# EasyEDA Pro project ProProject_无线温湿度检测系统1_2024-10-27.epro, board V2.0
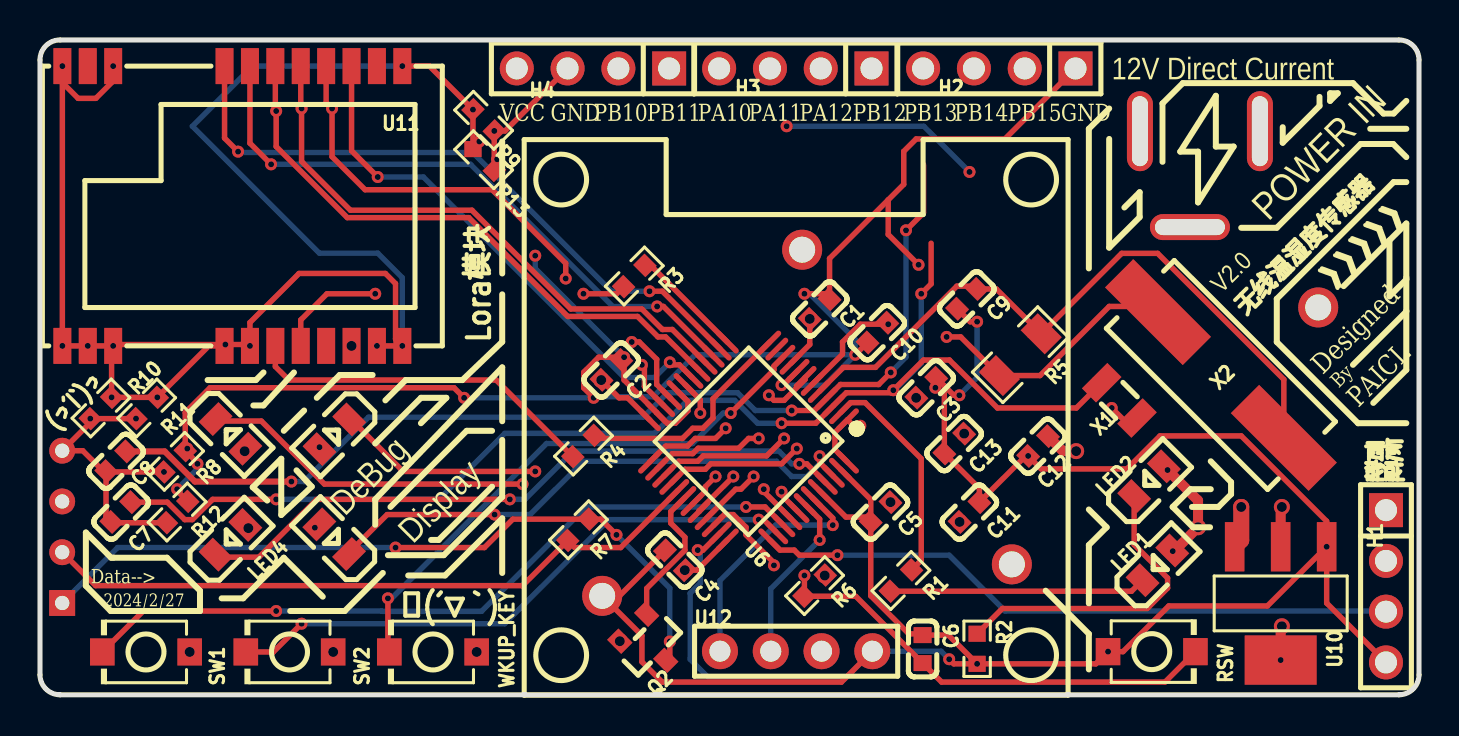
[diagram p5: board, top side]
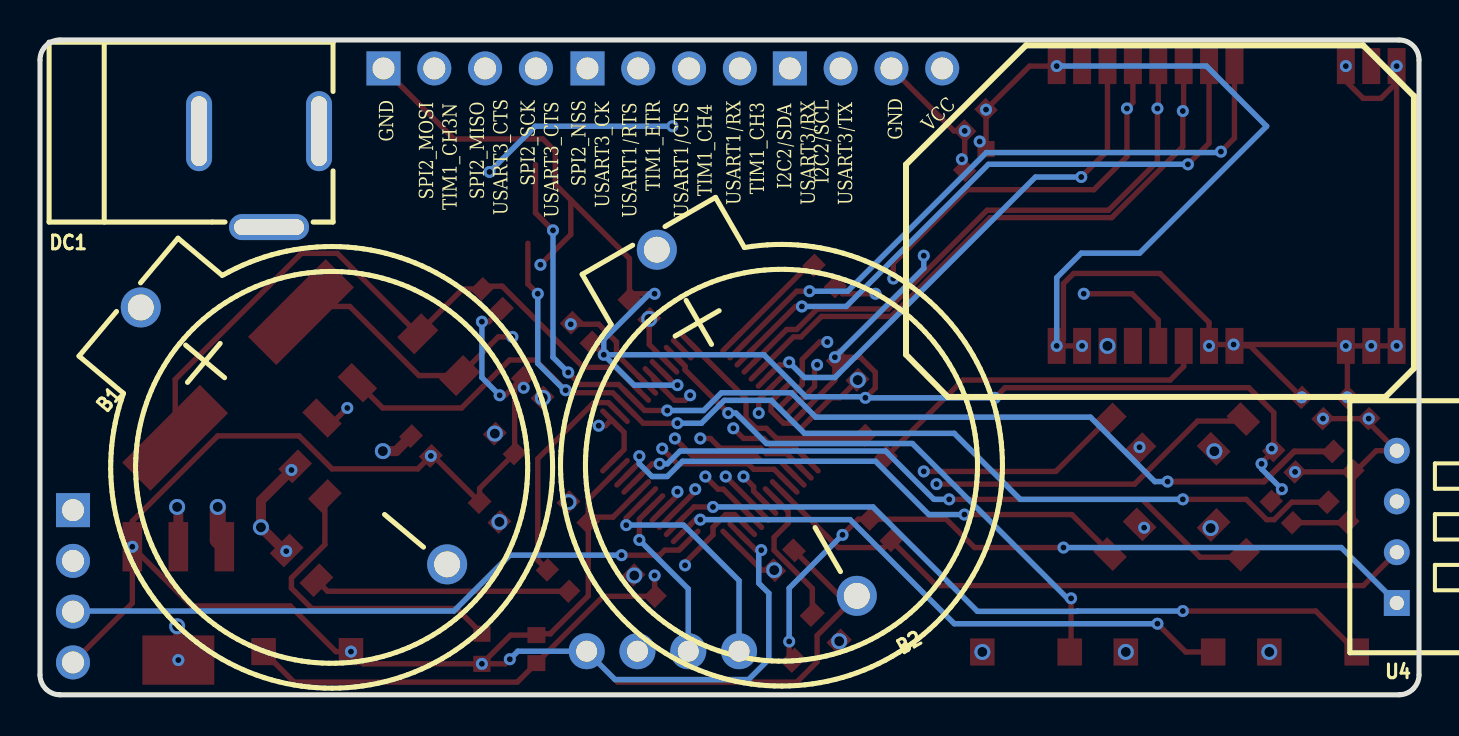
[diagram p6: board, bottom side, seen from below]

Outline 68.96 x 32.77 mm; copper layers: Top Layer, Inner1, Inner2, Bottom Layer. Coordinates in mm from the lower left corner of the outline.
Outline path: 0,31.77 0,1 arc(0.29,0.29) 1,0 67.96,0 arc(68.67,0.29) 68.96,1 68.96,31.77 arc(68.67,32.47) 67.96,32.77 1,32.77 arc(0.29,32.47) 0,31.77
Stack: Top Layer 0.035mm 外层铜厚1oz / Dielectric1 0.2104mm 7628 RC49% 8.6mil / Inner1 0.0152mm 内层铜厚 / Dielectric2 1.065mm 1.1mm H/HOZ 含铜 / Inner2 0.0152mm 内层铜厚 / Dielectric3 0.2104mm 7628 RC49% 8.6mil / Bottom Layer 0.035mm 外层铜厚1oz

## Design rules (mm)
template: JLCPCB Capability(Two Layers Board)
spacing copperThickness1oz (default): track to track 0.102, other pairs 0.152 to 0.3
spacing copperThickness2oz: track to track 0.203, other pairs 0.152 to 0.3
track width copperThickness1oz (default): min 0.127, default 0.254, max 2.54
track width copperThickness2oz: min 0.203, default 0.254, max 2.54
differential pair differentialPair (default): width min 0.127, default 0.254, max 2.54; gap min 0.152, default 0.152
via viaSize (default): diameter min 0.5, default 0.61, max 10; hole min 0.3, default 0.305, max 6.3

## Placement (name value [footprint] x y rotation side)
B1  BS-2-1  [BAT-TH_BS-2-1]  56.26 12.95 310 bottom
B2  BS-2-1  [BAT-TH_BS-2-1]  33.11 13.61 330 bottom
C1  100nF  [C0603]  38.99 19.3 225 top
C2  100nF  [C0603]  28.57 16.26 45 top
C3  100nF  [C0603]  44.32 15.37 45 top
C4  100nF  [C0603]  31.75 6.73 315 top
C5  100nF  [C0603]  42.04 9.14 45 top
C6  1uF  [C0603]  44.14 2.29 270 top
C7  20pF  [C0603]  4.06 9.14 45 top
C8  20pF  [C0603]  3.81 11.68 45 top
C9  20pF  [C0603]  46.35 19.81 45 top
C10  20pF  [C0603]  41.88 18.12 45 top
C11  100nF  [C0603]  46.48 9.14 45 top
C12  1uF  [C0603]  49.91 12.45 45 top
C13  1uF  [C0603]  45.72 12.57 45 top
DC1  DC-005 2.0  [DC-IN-TH_DC-5520-1]  58.01 25.8 180 bottom
H1  烧录  [HDR-TH_4P-P2.54-V-M]  67.31 5.43 270 top
H2  烧录  [HDR-TH_4P-P2.54-V-M]  47.97 31.34 180 top
H3  烧录  [HDR-TH_4P-P2.54-V-M]  37.77 31.34 180 top
H4  烧录  [HDR-TH_4P-P2.54-V-M]  27.65 31.34 180 top
LED1  NCD0805R1  [LED0805-R-RD]  55.88 6.48 45 top
LED2  NCD0805R1  [LED0805-R-RD]  55.46 10.69 45 top
LED3  NCD0805R1  [LED0805-R-RD]  14.71 7.78 135 top
LED4  NCD0805R1  [LED0805-R-RD]  9.53 7.76 45 top
LED5  NCD0805R1  [LED0805-R-RD]  9.53 13.05 315 top
LED6  NCD0805R1  [LED0805-R-RD]  14.72 13.03 225 top
Q2  AO3401A  [SOT-23_L2.9-W1.3-P1.90-LS2.4-BR]  30.48 2.54 135 top
R1  510Ω  [R0603]  43.05 5.72 45 top
R2  510Ω  [R0603]  46.86 2.3 270 top
R3  200Ω  [R0603]  29.72 20.95 45 top
R4  200Ω  [R0603]  27.18 12.45 45 top
R5  1mΩ  [R1206]  49.02 17.02 45 top
R6  10kΩ  [R0603]  38.74 5.46 45 top
R7  4.7kΩ  [R0603]  26.92 8.26 45 top
R8  510Ω  [R0603]  6.73 11.68 225 top
R9  510Ω  [R0603]  22.19 28.75 135 top
R10  510Ω  [R0603]  3.05 14.35 45 top
R11  510Ω  [R0603]  5.33 14.35 45 top
R12  510Ω  [R0603]  6.86 9.14 225 top
R13  510Ω  [r0603]  22.19 26.77 135 top
RSW  TS-1088R-02026  [SW-SMD_L3.9-W3.0-P4.45]  55.6 2.16 0 top
SW1  TS-1088-AR02016  [SW-SMD_L3.9-W3.0-P4.45]  5.3 2.14 180 top
SW2  TS-1088-AR02016  [SW-SMD_L3.9-W3.0-P4.45]  12.48 2.14 180 top
U4  DHT11  [SENSOR-TH_DHT11]  1.11 8.4 90 bottom
U6  STM32F103C8T6  [LQFP-48_L7.0-W7.0-P0.50-LS9.0-BL]  35.43 12.7 135 top
U10  AMS1117-3.3  [SOT-223-4_L6.5-W3.5-P2.30-LS7.0-BR]  62.04 4.57 90 top
U11  E22-400M22S  [WIRELM-SMD_E22-400M22S]  9.62 24.46 270 top
U12  HS96L03W2C03  [OLED-TH_L27.8-W27.2-P2.54_C9900033791]  37.81 2.18 180 top
WKUP_KEY  TS-1088-AR02016  [SW-SMD_L3.9-W3.0-P4.45]  19.65 2.14 180 top
X1  32.768kHz  [FC-135R_L3.2-W1.5]  53.97 14.73 135 top
X2  8MHz  [CRYSTAL-SMD_L11.5-W4.8-LS12.7]  59.06 16 135 top

## Footprints (pads in the part's own frame, mm; a bottom-side part is the same pattern mirrored in y, then rotated)
BAT-TH_BS-2-1
  round 2 hole 1.3: 1(0,-10) 2(0,10)
C0603
  rect 0.8x0.9 smd: 1(-0.7,0) 2(0.7,0)
CRYSTAL-SMD_L11.5-W4.8-LS12.7
  rect 5.5x2 smd: 1(-4.45,0) 2(4.45,0)
DC-IN-TH_DC-5520-1
  oval 4x1.3 hole 3.5x0.8: 2(0.5,-2.4)
  oval 1.3x4 hole 0.8x3.5: 3(-3,2.4) 4(3,2.4)
FC-135R_L3.2-W1.5
  rect 1x1.8 smd: 1(-1.25,0) 2(1.25,0)
HDR-TH_4P-P2.54-V-M
  rect 1.7x1.7 hole 1.1: 1(-3.81,0)
  round 1.7 hole 1.1: 2(-1.27,0) 3(1.27,0) 4(3.81,0)
LED0805-R-RD
  rect 1x1.399 smd: 1(1.05,0) 2(-1.05,0)
LQFP-48_L7.0-W7.0-P0.50-LS9.0-BL
  oval 0.27x1.5 smd: 1(-2.75,-4.25) 2(-2.25,-4.25) 3(-1.75,-4.25) 4(-1.25,-4.25) 5(-0.75,-4.25) 6(-0.25,-4.25) 7(0.25,-4.25) 8(0.75,-4.25) 9(1.25,-4.25) 10(1.75,-4.25) 11(2.25,-4.25) 12(2.75,-4.25) 25(2.75,4.25) 26(2.25,4.25) 27(1.75,4.25) 28(1.25,4.25) 29(0.75,4.25) 30(0.25,4.25) 31(-0.25,4.25) 32(-0.75,4.25) 33(-1.25,4.25) 34(-1.75,4.25) 35(-2.25,4.25) 36(-2.75,4.25)
  oval 1.5x0.27 smd: 13(4.25,-2.75) 14(4.25,-2.25) 15(4.25,-1.75) 16(4.25,-1.25) 17(4.25,-0.75) 18(4.25,-0.25) 19(4.25,0.25) 20(4.25,0.75) 21(4.25,1.25) 22(4.25,1.75) 23(4.25,2.25) 24(4.25,2.75) 37(-4.25,2.75) 38(-4.25,2.25) 39(-4.25,1.75) 40(-4.25,1.25) 41(-4.25,0.75) 42(-4.25,0.25) 43(-4.25,-0.25) 44(-4.25,-0.75) 45(-4.25,-1.25) 46(-4.25,-1.75) 47(-4.25,-2.25) 48(-4.25,-2.75)
OLED-TH_L27.8-W27.2-P2.54_C9900033791
  round 1.8 hole 1.05: 1(-3.81,0) 2(-1.27,0) 3(1.27,0) 4(3.81,0)
R0603
  rect 0.806x0.864 smd: 1(-0.753,0) 2(0.753,0)
r0603
  rect 0.806x0.864 smd: 1(-0.753,0)
  rect 0.806x0.864 smd rot 135: 2(0.753,0)
R1206
  rect 1.208x1.701 smd: 1(-1.479,0) 2(1.479,0)
SENSOR-TH_DHT11
  rect 1.296x1.296 hole 0.711: 1(-3.81,0)
  round 1.296 hole 0.711: 2(-1.27,0) 3(1.27,0) 4(3.81,0)
SOT-23_L2.9-W1.3-P1.90-LS2.4-BR
  rect 1x0.8 smd: 1(1.15,-0.95) 2(1.15,0.95) 3(-1.15,0)
SOT-223-4_L6.5-W3.5-P2.30-LS7.0-BR
  rect 2.47x0.98 smd: 1(2.835,-2.3) 2(2.835,0) 3(2.835,2.3)
  rect 2.47x3.6 smd: 4(-2.835,0)
SW-SMD_L3.9-W3.0-P4.45
  rect 1.23x1.36 smd: 1(-2.185,0) 2(2.185,0)
WIRELM-SMD_E22-400M22S
  rect 1.8x0.9 smd: 1(7,-8.5) 2(7,-7.23) 3(7,-5.96) 4(7,-0.39) 5(7,0.88) 6(7,2.15) 7(7,3.42) 8(7,4.69) 9(7,5.96) 10(7,7.23) 11(7,8.5) 12(-7,8.5) 13(-7,7.23) 14(-7,5.96) 15(-7,4.69) 16(-7,3.42) 17(-7,2.15) 18(-7,0.88) 19(-7,-0.39) 20(-7,-5.96) 21(-7,-7.23) 22(-7,-8.5)

## Nets
12V&B_VCC: B1.1 C12.2 DC1.4 U10.3
AGND: C7.1 C8.1 R8.2 R10.1 R11.1 R12.2 U4.4
DGND: R9.2 R10.2 R11.2 R13.2 U11.1 U11.2 U11.3 U11.4 U11.5 U11.10 U11.11 U11.12 U11.20 U11.22
GND: B2.2 C1.1 C2.2 C3.2 C4.1 C5.1 C6.1 C9.1 C10.1 C11.2 C12.1 C13.1 DC1.2 DC1.3 H1.4 H2.1 H4.3 R2.2 R8.1 R9.1 R12.1 R13.1 RSW.1 U6.8 U6.20 U6.23 U6.35 U6.44 U6.47 U10.1 U12.1
VCC: C1.2 C2.1 C3.1 C4.2 C5.2 C11.1 C13.2 H1.1 H4.4 LED1.1 LED2.1 LED3.1 LED4.1 LED5.1 LED6.1 Q2.2 R6.2 SW1.1 SW2.1 U6.1 U6.9 U6.24 U6.36 U6.48 U10.2 U10.4 U11.9 U12.2 WKUP_KEY.1
DHT11_VCC: Q2.3 R7.2 U4.1
NRST: C6.2 R6.1 RSW.2 U6.7
PA2/USART2_TX: R4.2 U6.12
PA3/USART2_RX: R3.2 U6.13
PA4/SPI1_NSS: U6.14 U11.19
PA5/SPI1_SCK: U6.15 U11.18
PA6/SPI1_MISO: U6.16 U11.16
PA7/SPI1_MOSI: U6.17 U11.17
PA8/DATA: R7.1 U4.2 U6.29
PA9/DHT11_CONTROL_VCC: Q2.1 U6.30
PA10/OUT: H3.4 U6.31
PA11/OUT: H3.3 U6.32
PA12/OUT: H3.2 U6.33
PA15/KEY2: SW2.2 U6.38
PB0/BUSY: U6.18 U11.14
PB1/NRST: U6.19 U11.15
PB3/KEY1: SW1.2 U6.39
PB4/DEBUG4: LED6.2 U6.40
PB5/DEBUG3: LED5.2 U6.41
PB6/I2C1_SCL: U6.42 U12.3
PB7/I2C1_SDA: U6.43 U12.4
PB8/DEBUG2: LED4.2 U6.45
PB9/DEBUG1: LED3.2 U6.46
PB10/OUT: H4.2 U6.21
PB11/OUT: H4.1 U6.22
PB12/OUT: H3.1 U6.25
PB13/OUT: H2.4 U6.26
PB14/OUT: H2.3 U6.27
PB15/OUT: H2.2 U6.28
PC13/TAMPER-RTC: R1.2 U6.2
PC14/OSC32_IN: C7.2 U6.3 X1.2
PC15/OSC32_OUT: C8.2 U6.4 X1.1
PD0/OSC_IN: C9.2 R5.2 U6.5 X2.1
PD1/OSC_OUT: C10.2 R5.1 U6.6 X2.2
SWDCLK: H1.3 U6.37
SWDIO: H1.2 U6.34
WKUP_KEY: U6.10 WKUP_KEY.2
$1N1536: LED2.2 R2.1
$1N1537: LED1.2 R1.1
$1N1721: R4.1 U11.6
$1N1727: R3.1 U11.7
$1N4011: B1.2 B2.1

Pads without a net: U4 3; U6 11; U11 8 13 21

## Via types
v1: diameter 0.6, hole 0.3, Top Layer to Bottom Layer, 103 vias
v2: diameter 0.8, hole 0.5, Top Layer to Bottom Layer, 20 vias

## Routing (per net, layer and track width the routed paths; a pad name or vN(x,y) marks a point on that pad's centre or on a via; arc(x,y) is an arc through that point)
12V&B_VCC: length 38.5
  Top Layer w0.5: 50.41,12.94 51.16,12.19 v2(51.82,12.19)
  Top Layer w0.8: U10.3 60.07,7.73 v2(60.07,9.4)
  Inner2 w0.8: DC1.4 57.01,28.2 63.92,21.3 B1.1 63.92,13.25 v2(60.07,9.4) 57.28,12.19 v2(51.82,12.19)
AGND: length 15.3
  Top Layer w0.27: R12.2 3.61,8.61 3.3,8.92 3.3,11.05 2.14,12.21 U4.4 2.52,13.62 v1(2.52,13.82) v1(4.8,13.82) ; v1(6.2,11.15) 3.35,11.15 C8.1
DGND: length 86.1
  Top Layer w0.27: v1(1.12,31.46) 1.12,30.63 ; 1.12,30.63 v1(1.12,17.46) v1(2.39,17.46) v1(3.66,17.46) ; 1.12,30.63 1.91,29.84 2.79,29.84 3.66,30.71 v1(3.66,31.46) ; v1(3.66,17.46) 3.73,17.53 v1(9.27,17.53) 10.43,17.53 v1(10.5,17.46) 10.5,18.63 12.95,21.08 17.27,21.08 17.78,20.57 17.78,17.8 v1(18.12,17.46) v1(16.85,17.46) ; v1(3.66,17.46) 3.58,17.38 v1(3.58,14.88) v1(5.87,14.88) 8.44,17.46 U11.4 ; R13.2 v1(21.65,29.28) 19.47,31.46 v1(18.12,31.46)
  Bottom Layer w0.27: v1(18.12,31.46) 10.63,31.46 7.62,28.45 13.97,22.1 16.89,22.1 18.12,20.87 v1(18.12,17.46)
  vias: v1(21.97,27.69)
GND: length 259.8
  Top Layer w0.27: 42.42,24.77 42.42,23.03 v1(43.93,21.52) ; 42.42,24.77 39.48,21.83 C1.1 39.22,20.07 v1(38.23,20.07) ; 42.42,24.77 43.19,25.54 43.19,27.19 43.81,27.81 48.25,27.81 H2.1 ; U6.8 37.17,15.49 v1(37.08,15.49) ; R12.1 6.86,10.21 v1(6.86,10.29) ; C5.1 41.3,8.89 40.3,8.89 U6.44 ; C5.1 41.54,4.95 43.43,3.06 43.43,3.05 44.07,3.05 C6.1 45.43,2.99 v1(46.86,1.55) ; C5.1 41.54,9.77 40.03,11.29 ; v1(46.86,1.55) 52.8,1.55 v1(53.41,2.16) 54.16,2.16 56.45,4.45 61.38,4.45 v1(64.34,7.41) ; v1(46.86,1.55) 45.7,1.55 v1(45.47,1.78) ; C10.1 v1(40.77,17.01) 40.77,16.89 ; v1(45.97,14.99) 45.69,14.99 45.22,15.45 ; v1(32.89,7.24) 33.15,7.24 34.02,8.1 ; C4.1 28.98,4.95 B2.2 30.1,2.97 30.1,1.65 31.12,0.64 40.08,0.64 U12.1 ; U6.20 32.4,14.67 32.4,14.21 31.78,13.59 31.36,13.59 U6.23 30.84,14.12 29.21,15.75 v1(29.21,16.89) 27.94,16.89 27.19,16.14 27.19,15.35 v1(27.69,14.86) ; C3.2 45.22,15.45 ; 45.22,15.45 45.22,12.08 46.98,10.33 C11.2 49.29,11.95 v1(49.42,11.95) 50.06,11.3 54.36,11.3 56.01,12.95 60.07,12.95 64.34,8.68 v1(64.34,7.41) ; 26.38,31.34 23.26,28.22 v1(22.72,28.22) R13.1 ; v1(46.86,18.67) 46.51,18.67 C9.1 ; v1(64.34,7.41) 64.34,4.59 H1.4 ; v1(21.21,14.86) 20.7,15.37 8.51,15.37 7.26,14.12 R8.1 7.87,11.61 v1(7.87,11.56)
  Inner1 w0.27: 26.38,31.34 26.38,23.59 v1(24.76,21.97) ; v1(43.93,21.52) 46.78,18.67 v1(46.86,18.67) ; DC1.3 57.87,31.34 H2.1 51.78,26.2 54.58,23.4 DC1.2
  Bottom Layer w0.27: v1(46.86,18.67) 46.86,15.88 v1(45.97,14.99) ; v1(40.77,17.01) 40.77,17.78 38.48,20.07 v1(38.23,20.07) ; v1(40.77,17.01) 32.76,17.01 30.66,14.91 27.74,14.91 v1(27.69,14.86) v1(21.21,14.86) ; v1(40.77,17.01) 39.25,15.49 v1(37.08,15.49) ; v1(24.76,21.97) 24.76,21.34 v1(29.21,16.89) ; v1(6.86,10.29) 7.87,11.3 v1(7.87,11.56) ; v1(45.47,1.78) 45.06,2.18 U12.1 40.21,0.76 33.53,0.76 32.51,1.78 32.51,5.08 33.02,5.59 33.02,7.11 v1(32.89,7.24)
  vias: v1(7.37,12.32) v1(22.86,26.8) v1(44.78,15.36)
VCC: length 213.8
  Top Layer w0.27: v2(28.07,15.75) 28.96,14.86 29.38,14.86 U6.24 ; v1(41.02,13.46) 40.68,13.46 U6.1 39.75,13.13 39.75,12.27 U6.48 ; v2(32.25,6.24) 32.86,6.24 U6.36 ; v2(39.24,5.97) R6.2 ; U6.9 38.49,17.53 v2(38.49,18.81)
  Top Layer w0.5: U10.2 62.04,9.34 v2(62.1,9.4) ; v2(62.1,3.43) 62.04,3.37 v1(62.04,1.74) ; LED1.1 56.75,7.22 v2(57.91,8.38) 57.91,9.72 LED2.1
  Inner2 w0.27: v1(37.34,28.45) 26.74,28.45 H4.4 ; v2(45.99,8.65) 45.99,6.59 48.64,3.94 50.67,3.94 56.39,9.65 v1(56.39,11.25) 50.86,11.25 50.29,11.81 50.29,13.97 45.97,18.29 45.97,25.65 v1(46.48,26.16) ; v2(62.1,9.4) 61.09,8.38 v2(57.91,8.38) ; v2(38.49,18.81) 38.49,15.99 v1(41.02,13.46)
  Inner2 w0.5: H1.1 67.15,9.4 v2(62.1,9.4) v2(62.1,3.43) ; v1(13.75,8.36) 13.73,8.34 v2(10.42,8.34) ; v2(42.53,9.64) 42.54,9.63 42.54,8.62 39.89,5.97 v2(39.24,5.97) 39.24,5.46 ; v2(42.53,9.64) 42.53,11.95 v1(41.02,13.46) 42.42,13.46 v2(43.81,14.86) 45.61,13.07 v2(46.22,13.07) ; v2(42.53,9.64) 45,9.64 v2(45.99,8.65) ; v2(10.42,8.34) 10.42,12 v2(10.23,12.19) 13.78,12.19 v1(13.98,12.39) 15.06,12.39 15.58,12.91 v2(15.58,17.46) ; v2(10.42,8.34) 10.42,5.08 v2(7.49,2.14) v2(14.66,2.14) v2(21.84,2.14) 28.46,2.14 v2(29,2.68) 29,2.99 v2(32.25,6.24) ; 39.24,5.46 39.24,2.34 U12.2 ; 39.24,5.46 38.48,4.7 33.78,4.7 v2(32.25,6.24) ; v2(32.25,6.24) 32,6.48 23.88,6.48 21.59,8.76 21.59,9.91 27.43,15.75 v2(28.07,15.75)
  Bottom Layer w0.27: v1(46.48,26.16) 44.2,28.45 v1(37.34,28.45)
  vias: v1(56.65,7.19)
DHT11_VCC: length 37.2
  Top Layer w0.27: v1(28.83,8) 28.04,8.79 R7.2 23.65,8.79 22.22,7.37 v1(17.78,7.37) ; 31.29,1.73 31.5,1.93 v1(31.5,2.67)
  Bottom Layer w0.27: v1(17.78,7.37) 3.88,7.37 U4.1 ; v1(31.5,2.67) 31.5,5.33 v1(28.83,8)
NRST: length 35.2
  Top Layer w0.27: v1(38.23,5.97) 38.23,4.95 R6.1 40.79,4.93 C6.2 45.09,0.64 56.26,0.64 RSW.2 ; U6.7 38.26,15.78 37.21,14.73 36.7,14.73 v1(36.45,14.99)
  Inner1 w0.27: v1(38.23,5.97) 38.23,9.91 36.58,11.56 36.58,13.08 36.45,13.21 v1(36.45,14.99)
PA2/USART2_TX: length 11.4
  Top Layer w0.27: U6.12 33.66,14.81 33.66,13.84 33.15,13.34 32.64,13.34 32.13,12.83 27.86,12.83 R4.2
PA3/USART2_RX: length 5.7
  Top Layer w0.27: R3.2 30.53,21.49 U6.13
PA4/SPI1_NSS: length 32.8
  Top Layer w0.27: 34.02,17.3 31.12,20.19 v1(30.48,20.19) ; v1(9.91,27.18) 9.23,27.86 U11.19
  Bottom Layer w0.27: v1(9.91,27.18) 9.95,27.13 21.64,27.13 28.57,20.19 v1(30.48,20.19)
PA5/SPI1_SCK: length 31.4
  Top Layer w0.27: v1(30.86,19.43) 31.18,19.43 U6.15 ; U11.18 10.5,27.6 v1(11.56,26.54)
  Bottom Layer w0.27: v1(30.86,19.43) 28.64,19.43 21.53,26.54 v1(11.56,26.54)
PA6/SPI1_MISO: length 29.2
  Top Layer w0.27: U11.16 13.04,29.38 v1(13.08,29.34) 13.08,26.69 15.52,24.25 21.6,24.25 26.54,19.3 30.1,19.3 31.12,18.28 31.62,18.28 U6.16
PA7/SPI1_MOSI: length 29.8
  Top Layer w0.27: U6.17 31.29,17.91 30.91,17.91 29.88,18.93 26.39,18.93 21.45,23.88 15.37,23.88 11.81,27.43 v1(11.81,29.21) 11.77,29.25 U11.17
PA8/DATA: length 33.7
  Top Layer w0.27: U6.29 29.04,7.37 26.75,7.37 R7.1 24.13,5.46 2.78,5.46 U4.2
PA9/DHT11_CONTROL_VCC: length 7.2
  Top Layer w0.27: U6.30 31.55,9.17 31.55,8.59 32.25,7.88 32.25,7.23 30.34,5.32 30.34,4.03
PA10/OUT: length 22.5
  Top Layer w0.27: v1(33.78,10.92) 33.27,10.41 33.27,10.19 U6.31
  Inner1 w0.27: v1(33.78,10.92) 33.69,11.01 33.69,16.82 33.96,17.09 H3.4
PA11/OUT: length 23.6
  Top Layer w0.27: U6.32 32.96,9.21 v1(34.67,10.92)
  Inner1 w0.27: v1(34.67,10.92) 34.67,12.89 34.93,13.14 34.93,13.46 35.13,13.67 35.13,29.97 H3.3
PA12/OUT: length 25.7
  Top Layer w0.27: v1(35.69,10.92) 35.05,10.29 34.79,10.29 U6.33
  Inner1 w0.27: H3.2 36.4,28.7 36.4,15.92 35.5,15.02 35.5,13.52 35.31,13.32 35.31,12.95 35.05,12.7 35.05,11.43 35.56,10.92 v1(35.69,10.92)
PA15/KEY2: length 29.6
  Top Layer w0.27: SW2.2 11.67,2.14 v1(13.08,3.56) ; v1(35.94,8.76) 36.19,8.76 U6.38
  Bottom Layer w0.27: v1(35.94,8.76) 28.45,8.76 23.24,3.56 v1(13.08,3.56)
PB0/BUSY: length 26.6
  Top Layer w0.27: U11.14 15.58,27.22 v1(16.89,25.91) ; v1(31.5,16.64) 31.62,16.51 31.98,16.51 U6.18
  Bottom Layer w0.27: v1(16.89,25.91) 19.18,25.91 29.21,15.88 30.73,15.88 v1(31.5,16.64)
PB1/NRST: length 32.4
  Top Layer w0.27: v1(26.29,20.83) 26.29,21.59 22.61,25.27 16.26,25.27 14.61,26.92 v1(14.61,29.34) 14.31,29.63 U11.15 ; U6.19 33.02,14.76 v1(33.02,14.1)
  Inner1 w0.27: v1(26.29,20.83) 27.31,20.83 27.94,20.19 27.94,17.15 30.99,14.1 v1(33.02,14.1)
PB3/KEY1: length 37.5
  Top Layer w0.27: v1(35.31,9.4) 36.26,9.4 U6.39 ; v1(11.81,4.19) 5.16,4.19 SW1.2
  Bottom Layer w0.27: v1(35.31,9.4) 27.31,9.4 22.08,4.18 17.1,4.18 17.08,4.19 v1(11.81,4.19)
PB4/DEBUG4: length 24.3
  Top Layer w0.27: v1(24.76,11.18) 18.16,11.18 15.46,13.88 ; v1(36.19,10.29) 36.19,10.17 U6.40
  Inner1 w0.27: v1(24.76,11.18) 32.51,11.18 33.4,10.29 v1(36.19,10.29)
PB5/DEBUG3: length 33.5
  Top Layer w0.27: U6.41 37.08,9.99 v1(37.08,10.16) ; v1(24.13,10.54) 14.22,10.54 11.07,13.7 8.78,13.7
  Inner1 w0.27: v1(24.13,10.54) 32.62,10.54 35.04,8.13 36.32,8.13 37.08,8.89 v1(37.08,10.16)
PB6/I2C1_SCL: length 8.7
  Top Layer w0.27: U6.42 38.99,8.79 v1(38.99,7.75)
  Bottom Layer w0.27: v1(38.99,7.75) 36.54,5.3 36.54,2.18
PB7/I2C1_SDA: length 12.1
  Top Layer w0.27: v1(39.64,8.49) 39.64,8.84 38.62,9.87
  Bottom Layer w0.27: v1(39.64,8.49) 36.78,8.49 34,5.72 U12.4
PB8/DEBUG2: length 33.3
  Top Layer w0.27: U6.45 38.34,11.56 v1(37.97,11.56) ; v1(23.5,9.78) 13.84,9.78 10.95,6.89 8.91,6.89
  Bottom Layer w0.27: v1(37.97,11.56) 37.59,11.56 36.96,12.19 26.67,12.19 24.26,9.78 v1(23.5,9.78)
PB9/DEBUG1: length 28
  Top Layer w0.27: U6.46 38.99,11.62 v1(38.99,11.94) ; v1(22.73,9.02) 17.36,9.02 15.22,6.88
  Bottom Layer w0.27: v1(38.99,11.94) 38.99,11.56 38.35,10.92 37.59,10.92 36.83,11.68 27.18,11.68 24.51,9.02 v1(22.73,9.02)
PB10/OUT: length 17.8
  Top Layer w0.27: U6.21 30.84,15.53 30.84,16.79 29.97,17.65 v1(29.59,17.65)
  Inner1 w0.27: v1(29.59,17.65) 28.92,18.32 H4.2
PB11/OUT: length 17.9
  Top Layer w0.27: U6.22 30.23,15.43 30.23,16.38 v1(30.1,16.51)
  Inner1 w0.27: H4.1 31.46,17.87 v1(30.1,16.51)
PB12/OUT: length 25.9
  Top Layer w0.27: v1(34.29,13.34) 33.78,12.83 32.77,12.83 32.38,12.45 31.29,12.45 U6.25
  Inner2 w0.27: H3.1 33.91,23.67 33.91,13.72 v1(34.29,13.34)
PB13/OUT: length 27.9
  Top Layer w0.27: v1(35.94,12.83) 35.43,12.83 34.94,12.34 32.91,12.34 32.64,12.07 31.62,12.07 U6.26
  Inner2 w0.27: H2.4 35.69,22.87 35.69,13.08 v1(35.94,12.83)
PB14/OUT: length 29.3
  Top Layer w0.27: v1(37.21,12.83) 36.34,11.95 33.16,11.95 32.89,11.68 31.94,11.68 U6.27
  Inner1 w0.27: v1(37.21,12.83) 39.12,14.73 39.12,18.29 41.53,20.7 41.53,26.17 H2.3
PB15/OUT: length 30.8
  Top Layer w0.27: v1(37.85,12.32) 37.08,11.56 33.54,11.56 33.27,11.28 32.25,11.28 U6.28
  Inner1 w0.27: v1(37.85,12.32) 39.75,14.22 39.75,17.53 42.54,20.32 42.54,24.64 H2.2
PC13/TAMPER-RTC: length 11.2
  Top Layer w0.27: R1.2 44.07,6.73 44.07,11.81 41.26,14.62 40.53,14.62 40.03,14.11
PC14/OSC32_IN: length 62.8
  Top Layer w0.27: v1(11.81,9.78) 8.64,9.78 7.62,8.76 7.24,8.76 6.36,9.64 4.56,9.64 ; v1(37.08,13.59) 38.8,13.59 U6.3 40.32,15.11 42.54,15.11 v1(42.67,15.24) 44.18,16.75 45.48,16.75 47.88,14.35 51.83,14.35 X1.2 ; 44.56,22.59 44.56,20.56 v1(44.07,20.07)
  Bottom Layer w0.27: v1(44.07,20.07) 44.07,16.58 42.73,15.24 v1(42.67,15.24) ; v1(37.08,13.59) 35.88,13.59 34.74,14.73 32.38,14.73 30.73,13.08 23.24,13.08 19.94,9.78 v1(11.81,9.78)
PC15/OSC32_OUT: length 66.3
  Top Layer w0.27: 44.18,26.53 44.18,24.12 v1(43.31,23.24) ; v1(53.59,14.35) 54.23,13.72 54.73,13.72 54.86,13.85 ; v1(42.54,16.13) 41.94,15.53 40.03,15.53 U6.4 38.72,14.22 v1(37.59,14.22)
  Top Layer w0.3: C8.2 6.24,12.18 7.75,10.67 v1(12.57,10.67)
  Inner1 w0.27: v1(42.54,16.13) 51.82,16.13 v1(53.59,14.35)
  Bottom Layer w0.27: v1(37.59,14.22) 35.77,14.22 34.88,15.11 31.39,15.11 30.16,13.89 16.43,13.89 13.21,10.67 v1(12.57,10.67) ; v1(42.54,16.13) 43.31,16.89 v1(43.31,23.24)
PD0/OSC_IN: length 33.6
  Top Layer w0.27: U6.5 40.18,16.38 41.78,16.38 45.85,20.45 46.71,20.45 C9.2 47.82,20.31 R5.2 54.09,22.09 55.89,22.09 62.2,15.78 X2.1
PD1/OSC_OUT: length 21.5
  Top Layer w0.27: X2.2 55.63,19.43 53.47,19.43 50.01,15.97 R5.1 46.04,17.91 v1(45.34,17.91) ; 38.62,15.53 40.13,17.05 40.13,17.65 41.02,18.54 v1(42.42,18.54)
  Inner1 w0.27: v1(42.42,18.54) 44.7,18.54 v1(45.34,17.91)
SWDCLK: length 32.3
  Top Layer w0.27: v1(39.88,6.98) 37.97,6.98 37.72,7.24 37,7.24 U6.37
  Bottom Layer w0.27: v1(39.88,6.98) 45.47,6.98 48.26,4.19 67.28,4.19 H1.3
SWDIO: length 36.6
  Top Layer w0.27: v1(36.7,6.48) 36.7,6.6 35.31,8 35.31,8.38 34.67,9.02 34.22,9.02 U6.34
  Inner1 w0.27: 36.7,6.48 38.23,4.95 65.56,4.95 H1.2
WKUP_KEY: length 27.6
  Top Layer w0.27: v1(34.54,14.1) 36.7,16.26 36.7,16.45 U6.10 ; v1(17.4,4.83) 17.4,2.21 17.47,2.14
  Bottom Layer w0.27: v1(17.4,4.83) 17.58,4.83 25.33,12.57 32.64,12.57 34.16,14.1 v1(34.54,14.1)
$1N1536: length 15.8
  Top Layer w0.27: R2.1 48.13,4.32 55.37,4.32 56.39,5.33 56.39,5.84 54.72,7.52 LED2.2
$1N1537: length 12.8
  Top Layer w0.27: LED1.2 54.59,5.18 R1.1
$1N1721: length 17.8
  Top Layer w0.27: R4.1 22.81,15.75 12.45,15.75 11.77,16.43 U11.6
$1N1727: length 18.1
  Top Layer w0.27: v1(27.18,20.07) 28.83,20.07 R3.1 ; U11.7 13.04,18.75 14.35,20.07 v1(16.76,20.07)
  Inner1 w0.27: v1(16.76,20.07) v1(27.18,20.07)
$1N4011: length 22
  Inner2 w0.8: B1.2 48.6,8.68 47.75,9.53 47.75,14.72 45.58,16.89 44.83,16.89 44.32,17.4 44.32,18.61 40.66,22.27 B2.1

## Copper pours and planes (outline as drawn; the poured copper is in the pictures)
DGND on Inner1: 0,32.77 22.61,32.77 22.61,14.73 0,14.73

## Text on the board
Bottom Silkscreen Layer: VCC | I2C2/SDA / USART3/RX | USART1/RX / TIM1_CH3 | USART1/CTS / TIM1_CH4 | USART1/RTS / TIM1_ETR | SPI2_NSS / USART3_CK | SPI2_SCK / USART3_CTS | SPI2_MISO / USART3_CTS | SPI2_MOSI / TIM1_CH3N | I2C2/SCL / USART3/TX | GND
Top Silkscreen Layer: V2.0 | 无线温湿度传感器 | 12V Direct Current | POWER IN | Lora模块 | DeBug | Display | By | Designed | PAICL | 》》》》》 | 龘 | 2024/2/27 | Data--> | (っ´Ι`)っ | ♪(´▽｀) | VCC | GND | PB10 | PB11 | PA10 | PA11 | PA12 | PB12 | PB13 | PB14 | PB15
